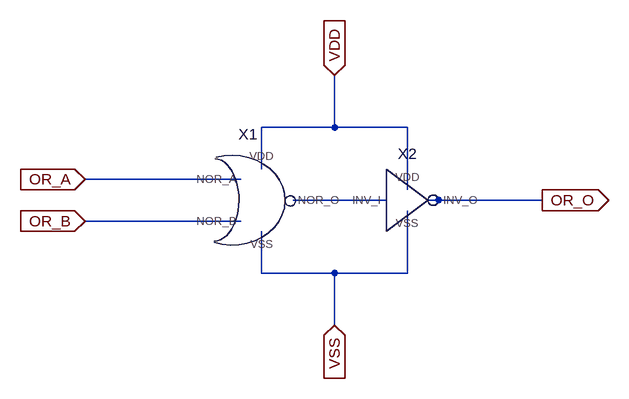
[diagram p0: schematic m_Or.asc]
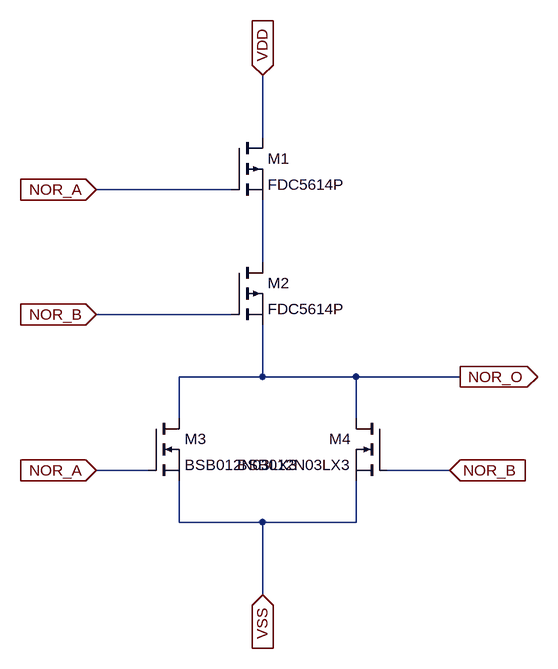
[diagram p1: sub-circuit m_nor.asc]
m_Or.asc, the LTspice schematic file:
Version 4
SHEET 1 880 680
WIRE 320 48 320 -32
WIRE 320 48 208 48
WIRE 432 48 320 48
WIRE 208 112 208 48
WIRE 176 128 -64 128
WIRE 432 144 432 48
WIRE 400 160 256 160
WIRE 640 160 464 160
WIRE 176 192 -64 192
WIRE 208 272 208 208
WIRE 320 272 208 272
WIRE 432 272 432 176
WIRE 432 272 320 272
WIRE 320 352 320 272
FLAG 640 160 OR_O
IOPIN 640 160 Out
FLAG -64 128 OR_A
IOPIN -64 128 In
FLAG -64 192 OR_B
IOPIN -64 192 In
FLAG 320 -32 VDD
IOPIN 320 -32 In
FLAG 320 352 VSS
IOPIN 320 352 In
SYMBOL m_Nor 256 160 R0
SYMATTR InstName X1
SYMBOL m_Inverter 432 160 R0
SYMATTR InstName X2

m_nor.asc, the sub-circuit schematic file:
Version 4
SHEET 1 880 680
WIRE 144 -224 144 -320
WIRE 96 -144 -112 -144
WIRE 144 -32 144 -128
WIRE 96 48 -112 48
WIRE 144 144 144 64
WIRE 144 144 16 144
WIRE 288 144 144 144
WIRE 448 144 288 144
WIRE 16 208 16 144
WIRE 288 208 288 144
WIRE -32 288 -112 288
WIRE 432 288 336 288
WIRE 16 368 16 304
WIRE 144 368 16 368
WIRE 288 368 288 304
WIRE 288 368 144 368
WIRE 144 480 144 368
FLAG 144 480 VSS
IOPIN 144 480 In
FLAG 144 -320 VDD
IOPIN 144 -320 In
FLAG 448 144 NOR_O
IOPIN 448 144 Out
FLAG -112 288 NOR_A
IOPIN -112 288 In
FLAG -112 -144 NOR_A
IOPIN -112 -144 In
FLAG -112 48 NOR_B
IOPIN -112 48 In
FLAG 432 288 NOR_B
IOPIN 432 288 In
SYMBOL pmos 96 -224 R0
SYMATTR InstName M1
SYMATTR Value FDC5614P
SYMBOL pmos 96 -32 R0
SYMATTR InstName M2
SYMATTR Value FDC5614P
SYMBOL nmos -32 208 R0
SYMATTR InstName M3
SYMATTR Value BSB012N03LX3
SYMBOL nmos 336 208 M0
SYMATTR InstName M4
SYMATTR Value BSB012N03LX3

The netlist it stands for:
* m_Or.asc
XX1 OR_A OR_B VDD VSS N001 m_nor
XX2 N001 VDD VSS OR_O m_Inverter  ; pins INV_I VDD VSS INV_O

* block symbol definitions
.subckt m_nor NOR_A NOR_B VDD VSS NOR_O
M1 VDD NOR_A N001 N001 FDC5614P
M2 N001 NOR_B NOR_O NOR_O FDC5614P
M3 NOR_O NOR_A VSS VSS BSB012N03LX3
M4 NOR_O NOR_B VSS VSS BSB012N03LX3
.ends m_nor

.model NMOS NMOS
.model PMOS PMOS
.lib standard.mos
.backanno
.end